# Altium schematic sheet schematic.SchDoc
size A3
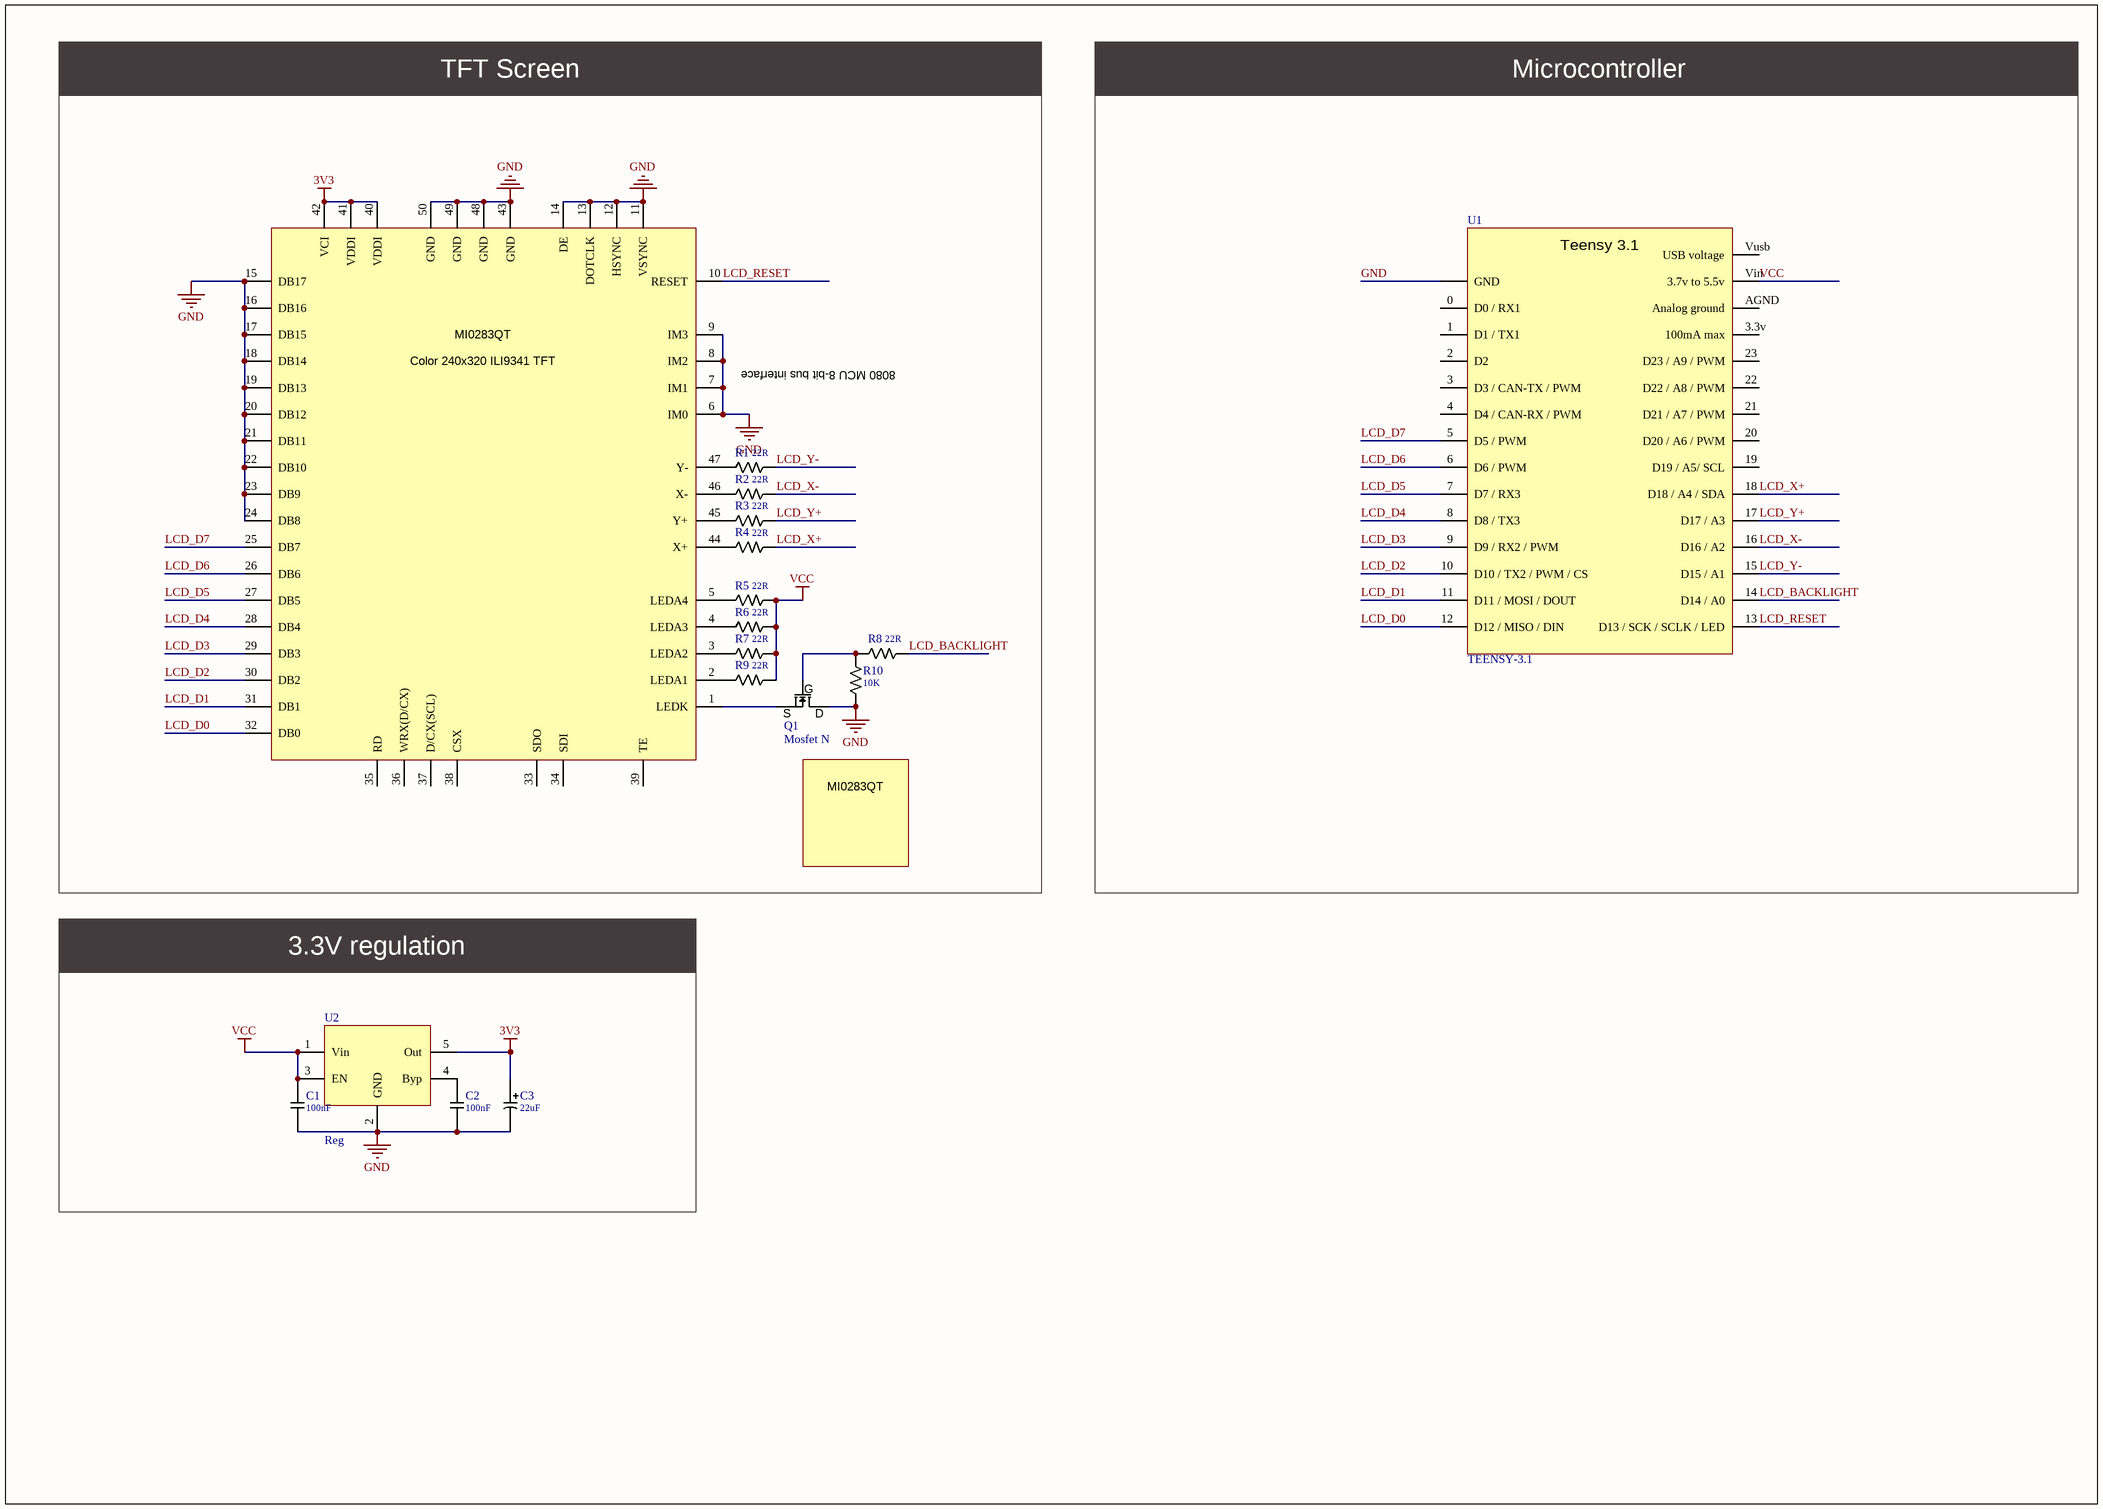
[diagram p0: schematic.SchDoc]

## Parts
C1  value 100nF  [CAP-0603-GEN]  (hidden comment: CAPACITOR)
C2  value 100nF  [CAP-0603-GEN]  (hidden comment: CAPACITOR)
C3  value 22uF  [CAP-0603-POL]  (hidden comment: CAPACITOR-POLARIZED)
Q1  Mosfet N  [SOT23-3]
R1  value 22R  [RESISTOR-0603]  (hidden comment: RESISTOR)
R2  value 22R  [RESISTOR-0603]  (hidden comment: RESISTOR)
R3  value 22R  [RESISTOR-0603]  (hidden comment: RESISTOR)
R4  value 22R  [RESISTOR-0603]  (hidden comment: RESISTOR)
R5  value 22R  [RESISTOR-0603]  (hidden comment: RESISTOR)
R6  value 22R  [RESISTOR-0603]  (hidden comment: RESISTOR)
R7  value 22R  [RESISTOR-0603]  (hidden comment: RESISTOR)
R8  value 22R  [RESISTOR-0603]  (hidden comment: RESISTOR)
R9  value 22R  [RESISTOR-0603]  (hidden comment: RESISTOR)
R10  value 10K  [RESISTOR-0603]  (hidden comment: Resistor)
TFT1  TFT  [FCI-62684-50210E9ALF]  (value not drawn)
TFT2  Screen  [MI0283QT]  (value not drawn)
U1  TEENSY-3.1  [TEENSY-3.1]
U2  Reg  [SOT23-5]

## Blocks framed on the sheet
TFT Screen: Q1 R1-R10 TFT1 TFT2
Microcontroller: U1
3.3V regulation: C1-C3 U2

## Nets
3V3: C3.1 TFT1.40(VDDI) TFT1.41(VDDI) TFT1.42(VCI) U2.5(Out)
GND: C1.1 C2.1 C3.2 Q1.3(Drain) R10.2 TFT1.6(IM0) TFT1.7(IM1) TFT1.8(IM2) TFT1.9(IM3) TFT1.11(VSYNC) TFT1.12(HSYNC) TFT1.13(DOTCLK) TFT1.14(DE) TFT1.15(DB17) TFT1.16(DB16) TFT1.17(DB15) TFT1.18(DB14) TFT1.19(DB13) TFT1.20(DB12) TFT1.21(DB11) TFT1.22(DB10) TFT1.23(DB9) TFT1.24(DB8) TFT1.43(GND) TFT1.48(GND) TFT1.49(GND) TFT1.50(GND) U1.GND U2.2(GND)
VCC: C1.2 R5.2 R6.2 R7.2 R9.2 U1.Vin(3.7v_to_5.5v) U2.1(Vin) U2.3(EN)
LCD_BACKLIGHT: R8.2 U1.14(D14_/_A0)
LCD_D0: TFT1.32(DB0) U1.12(D12_/_MISO_/_DIN)
LCD_D1: TFT1.31(DB1) U1.11(D11_/_MOSI_/_DOUT)
LCD_D2: TFT1.30(DB2) U1.10(D10_/_TX2_/_PWM_/_CS)
LCD_D3: TFT1.29(DB3) U1.9(D9_/_RX2_/_PWM)
LCD_D4: TFT1.28(DB4) U1.8(D8_/_TX3)
LCD_D5: TFT1.27(DB5) U1.7(D7_/_RX3)
LCD_D6: TFT1.26(DB6) U1.6(D6_/_PWM)
LCD_D7: TFT1.25(DB7) U1.5(D5_/_PWM)
LCD_RESET: TFT1.10(RESET) U1.13(D13_/_SCK_/_SCLK_/_LED)
LCD_X+: R4.2 U1.18(D18_/_A4_/_SDA)
LCD_X-: R2.2 U1.16(D16_/_A2)
LCD_Y+: R3.2 U1.17(D17_/_A3)
LCD_Y-: R1.2 U1.15(D15_/_A1)
NetC2_2: C2.2 U2.4(Byp)
NetQ1_1: Q1.1(Gate) R8.1 R10.1
NetQ1_2: Q1.2(Source) TFT1.1(LEDK)
NetR1_1: R1.1 TFT1.47(Y-)
NetR2_1: R2.1 TFT1.46(X-)
NetR3_1: R3.1 TFT1.45(Y+)
NetR4_1: R4.1 TFT1.44(X+)
NetR5_1: R5.1 TFT1.5(LEDA4)
NetR6_1: R6.1 TFT1.4(LEDA3)
NetR7_1: R7.1 TFT1.3(LEDA2)
NetR9_1: R9.1 TFT1.2(LEDA1)

Not connected (* = marked no-connect by the designer): TFT1 33(SDO) 34(SDI) 35(RD) 36(WRX(D/CX)) 37(D/CX(SCL)) 38(CSX) 39(TE); U1 0(D0_/_RX1) 1(D1_/_TX1) 2(D2) 3(D3_/_CAN-TX_/_PWM) 3.3v(100mA_max) 4(D4_/_CAN-RX_/_PWM) 19(D19_/_A5/_SCL) 20(D20_/_A6_/_PWM) 21(D21_/_A7_/_PWM) 22(D22_/_A8_/_PWM) 23(D23_/_A9_/_PWM) AGND(Analog_ground) Vusb(USB_voltage)

## Notes on the sheet
- (near TFT1) 8080 MCU 8-bit bus interface
- (in symbol MI0283QT-11) MI0283QT; Color 240x320 ILI9341 TFT
- (in symbol MOSFET-N) G; S; D
- (in symbol TEENSY-3.1) Teensy 3.1

## Library data of the parts
C3 = CAPACITOR-POLARIZED: Polarized capacitor
Q1 = MOSFET-N: N-channel mosfet
TFT1 = MI0283QT-11: MI0283QT 2.8" TFT
TFT2 = MI0283QT: MI0283QT TFT screen
U1 = TEENSY-3.1: Teensy 3.1 breakout
U2 = SOT23-REG: Voltage regulator